# EasyEDA Pro project FSS1500-HANDv2.0.eprj

# Schematic Schematic1
Create Date: 2022-12-30; Page Name: P1; Project Name: FSS1500-HAND; Schematic Name: Schematic1; Update Date: 2023-02-28
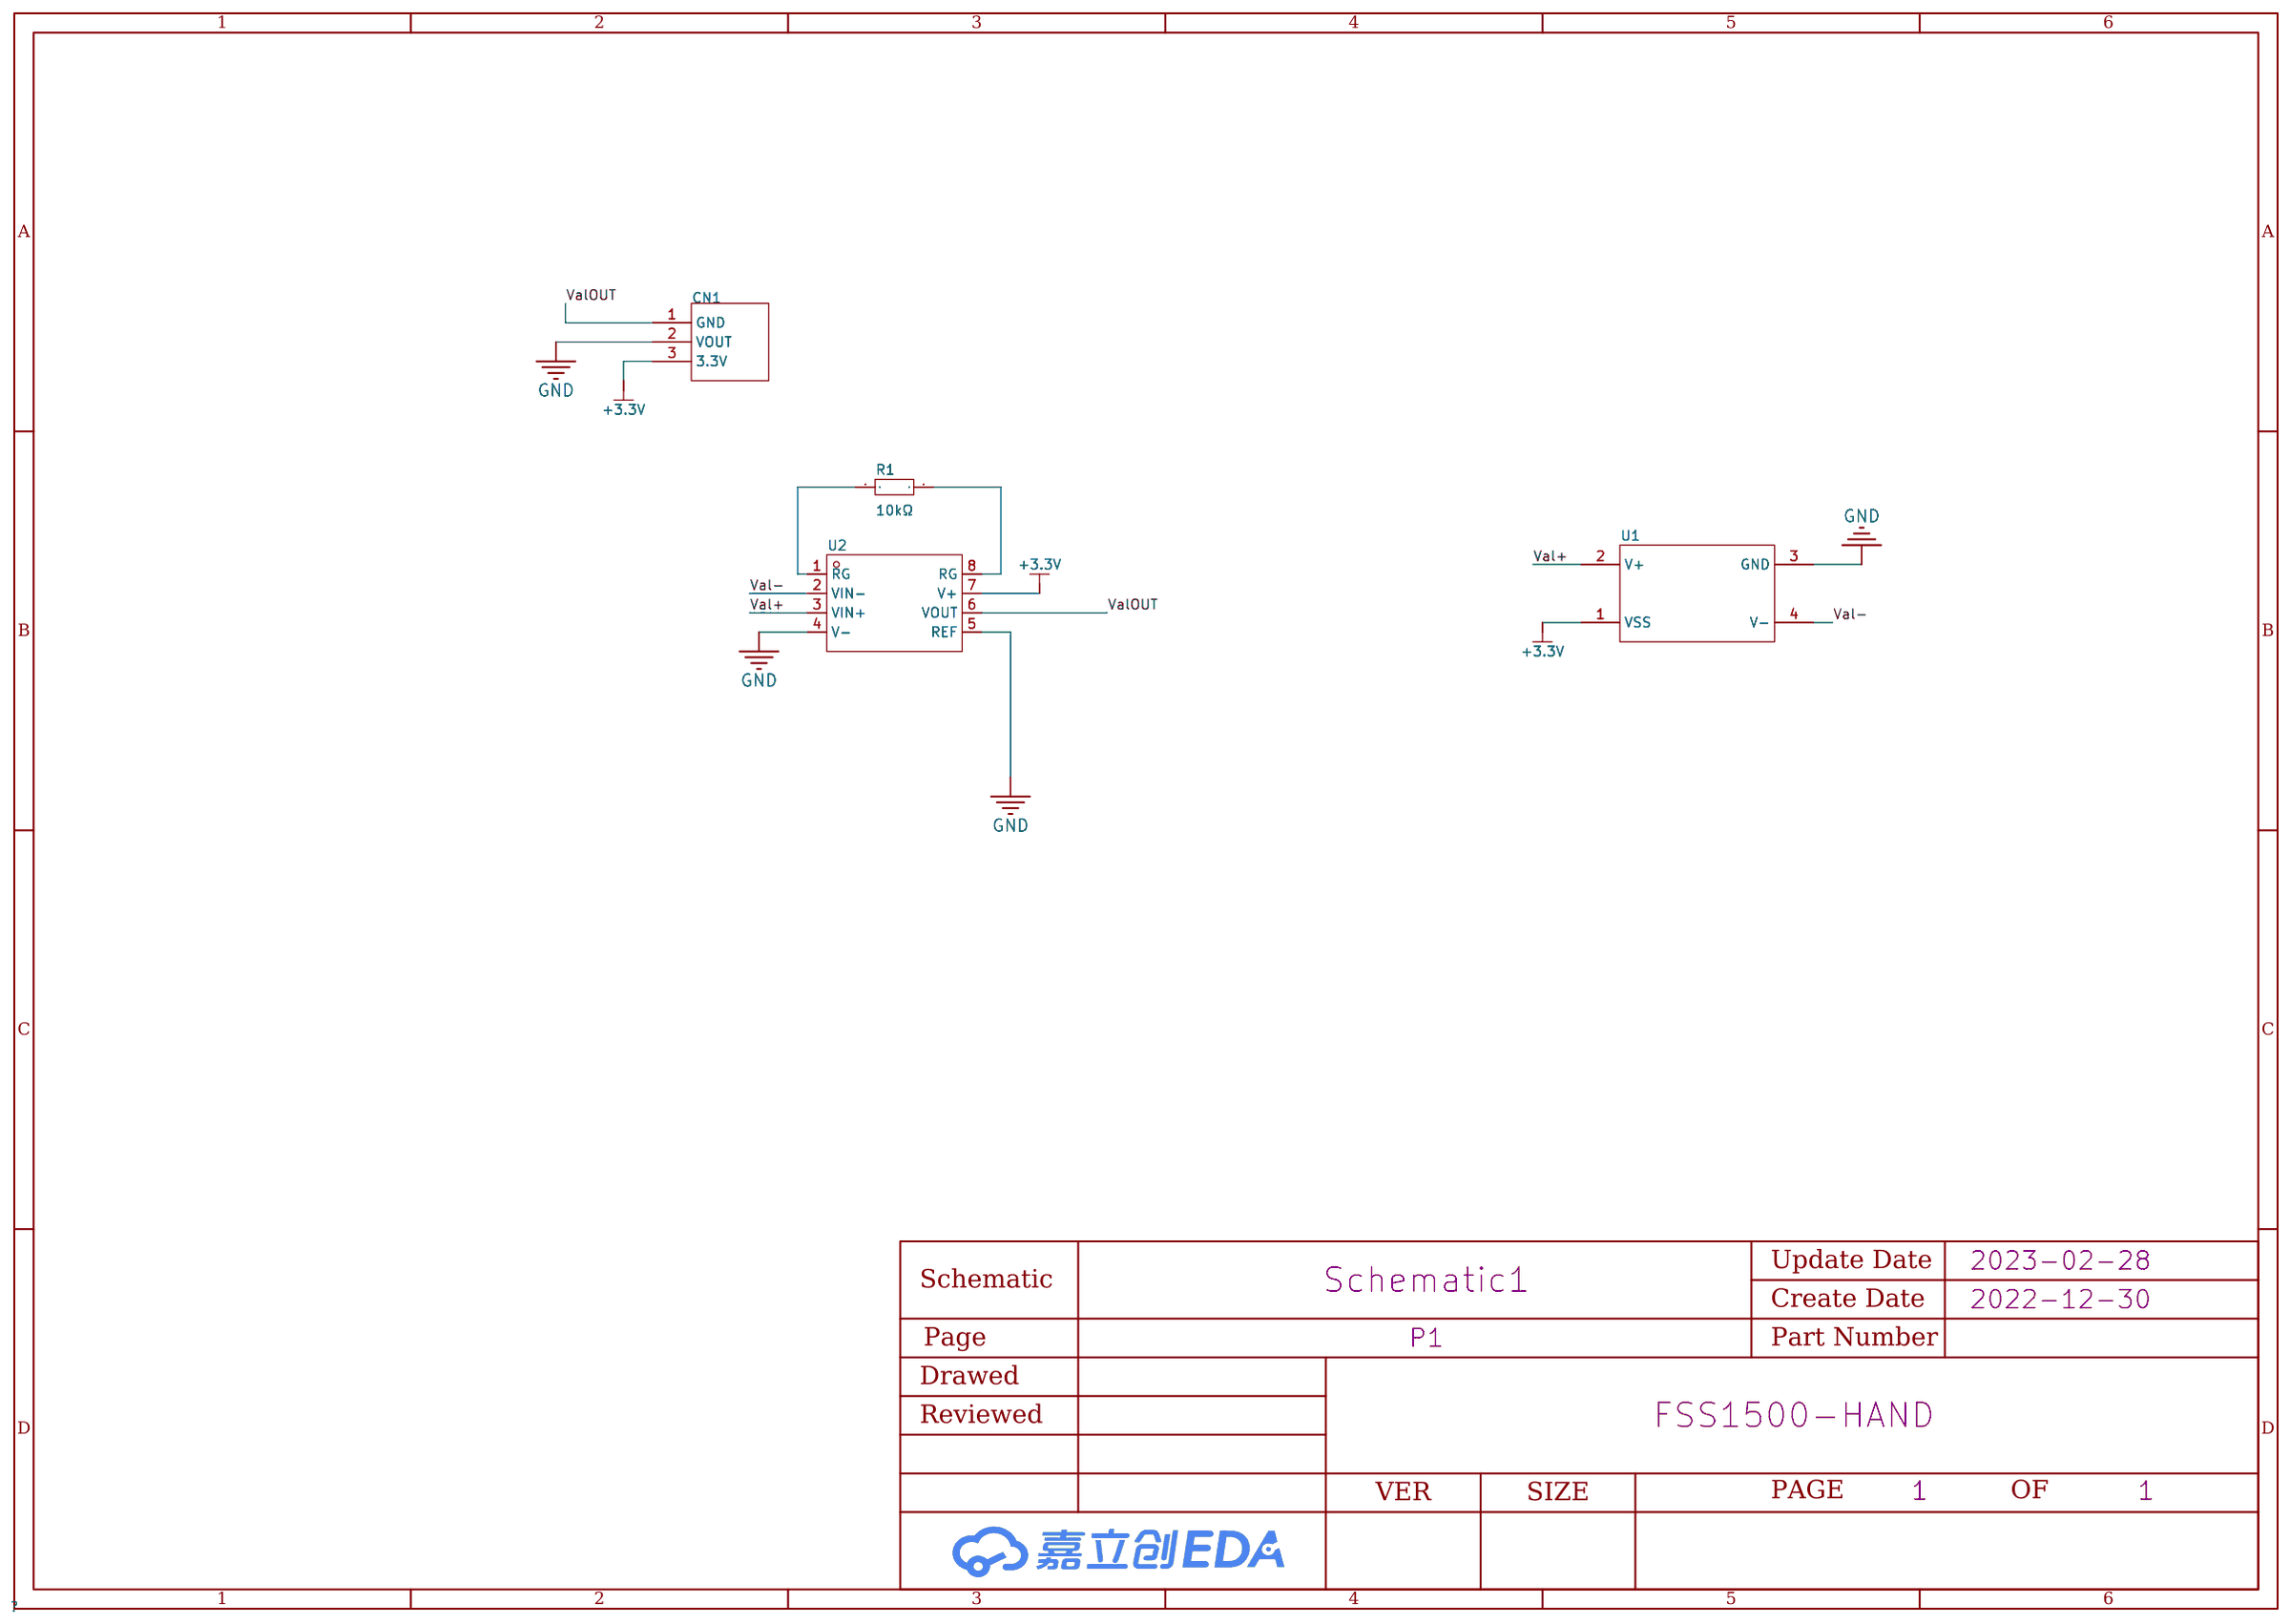
[diagram p0: schematic sheet]

## Parts
CN1  -  [3POINT]
R1  10kΩ  [R0603]
U1  -  [FSS1500NST]
U2  INA333AIDGKR  [MSOP-8_L3.0-W3.0-P0.65-LS5.0-BL]

## Library data of the parts
CN1 = 3POINT
R1 = CR0603JA0103G: 电阻类型:厚膜电阻;阻值:10kΩ;精度:±5%;功率:1/10W;温度系数:±200ppm/;最大工作电压:50V;工作温度范围:-55~+125;; LCSC Part Name: 10kΩ ±5%; Supplier Part: C101254; Manufacturer: LIZ(丽智电子); Supplier Footprint: 0603; JLCPCB Part Class: Extended Part; Datasheet: https://atta.szlcsc.com/upload/public/pdf/source/20170408/1491631441449.pdf; Supplier: LCSC; Type: 厚膜电阻; Tolerance: ±5%; Power(Watts): 1/10W; Temperature Coefficient: ±200ppm/; Overload Voltage (Max): 50V; Operating Temperature Range: -55~+125
U1 = FSS1500
U2 = INA333AIDGKR: 运放类型:Instrumentation;放大器组数:1;增益带宽积（GBP）:-;压摆率（SR）:0.16 V/us;电源电压:1.8V ~ 5.5V, ±0.9V ~ 2.75V;各通道供电电流:75uA;; Supplier Part: C19450; Manufacturer: TI(德州仪器); Supplier Footprint: VSSOP-8; JLCPCB Part Class: Extended Part; Datasheet: https://atta.szlcsc.com/upload/public/pdf/source/20130925/1457706651096.pdf; Supplier: LCSC; Amplifier Type: Instrumentation; Number of Circuits: 1; Slew Rate（SR）: 0.16 V/us; Output Type: Rail-to-Rail; Supply Voltage（Single）: 1.8V ~ 5.5V, ±0.9V ~ 2.75V; Iq per channel (Typ): 75uA; Operating Temperature: -40°C ~ 125°C

## Nets
+3.3V: CN1.3(3.3V) U1.1(VSS) U2.7(V+)
GND: CN1.2(VOUT) U1.3(GND) U2.4(V-) U2.5(REF)
Val+: U1.2(V+) U2.3(VIN+)
Val-: U1.4(V-) U2.2(VIN-)
ValOUT: CN1.1(GND) U2.6(VOUT)
$1N427: R1.1 U2.1(RG)
$1N434: R1.2 U2.8(RG)

# Board PCB1
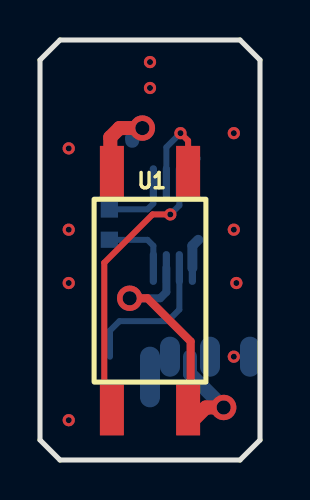
[diagram p1: board, top side]
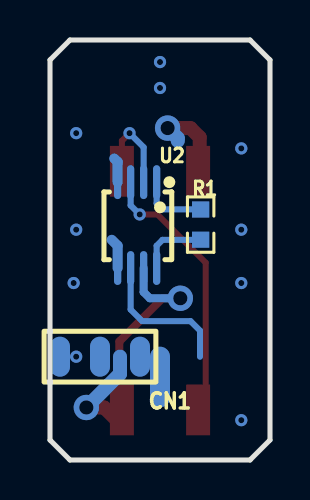
[diagram p2: board, bottom side, seen from below]

Outline 11 x 21 mm; copper layers: Top Layer, Bottom Layer. Coordinates in mm from the lower left corner of the outline.
Outline path: 0,20 0,1 1,0 10,0 11,1 11,20 10,21 1,21 0,20
Stack: Top Layer 0.035mm / Dielectric1 1.51mm FR4 er 4.5 / Bottom Layer 0.035mm

## Design rules (mm)
spacing safeClearance (default): track to track 0.152, other pairs 0.152 to 0.3
track width trackWidth (default): min 0.127, default 0.254, max 2.54
differential pair differentialPair (default): width min 0.127, default 0.254, max 2.54; gap min 0.152, default 0.152
via viaSize (default): diameter min 0.5, default 0.61, max 10; hole min 0.3, default 0.305, max 6

## Placement (name value [footprint] x y rotation side)
CN1  -  [3POINT]  5.5 5.17 0 bottom
R1  10kΩ  [R0603]  3.47 11.77 270 bottom
U1  -  [FSS1500NST]  5.5 8.47 90 top
U2  INA333AIDGKR  [MSOP-8_L3.0-W3.0-P0.65-LS5.0-BL]  6.64 11.75 0 bottom

## Footprints (pads in the part's own frame, mm; a bottom-side part is the same pattern mirrored in y, then rotated)
3POINT
  oval 1x2 smd: 1(1,0) 2(3,0) 3(5,0)
FSS1500NST
  rect 2.54x1.2 smd: 1(-5.967,-1.905) 2(-5.967,1.905) 3(5.967,1.905) 4(5.967,-1.905)
MSOP-8_L3.0-W3.0-P0.65-LS5.0-BL
  oval 0.363x1.692 smd: 1(-0.976,-2.147) 2(-0.325,-2.147) 3(0.325,-2.147) 4(0.976,-2.147) 5(0.976,2.147) 6(0.325,2.147) 7(-0.325,2.147) 8(-0.976,2.147)
R0603
  rect 0.807x0.864 smd: 1(-0.754,0) 2(0.754,0)

## Nets
+3.3V: CN1.3 U1.1 U2.7
GND: CN1.2 U1.3 U2.4 U2.5
VAL+: U1.2 U2.3
VAL-: U1.4 U2.2
VALOUT: CN1.1 U2.6
$1N427: R1.1 U2.1
$1N434: R1.2 U2.8

## Via types
v1: diameter 0.61, hole 0.305, Top Layer to Bottom Layer, 12 vias
v2: diameter 1.27, hole 0.711, Top Layer to Bottom Layer, 3 vias

## Routing (per net, layer and track width the routed paths; a pad name or vN(x,y) marks a point on that pad's centre or on a via; arc(x,y) is an arc through that point)
+3.3V: length 15.6
  Top Layer w0.4: 7.53,2.63 7.53,5.93 5.37,8.09 v2(4.48,8.09)
  Top Layer w0.7: v2(9.18,2.63) 8.29,2.63 7.53,1.86
  Bottom Layer w0.4: U2.7 6.32,8.4 6.01,8.09 v2(4.48,8.09)
  Bottom Layer w0.7: 7.5,5.17 7.5,4.31 v2(9.18,2.63)
GND: length 9.2
  Top Layer w0.7: U1.3 3.51,14.52 3.51,16.13 3.98,16.6 v2(5.12,16.6)
  Bottom Layer w0.5: U2.4 7.62,14.9 7.79,15.07 ; 7.91,11.01 7.62,10.71 U2.5
  Bottom Layer w0.7: 4.61,15.96 4.61,16.09 v2(5.12,16.6)
  Bottom Layer w1: 5.5,5.17 5.5,3.13
  vias: v1(1.44,15.58) v1(1.44,11.52) v1(1.44,8.85) v1(1.44,1.99) v1(5.5,19.9) v1(5.5,18.6) v1(9.69,16.34) v1(9.69,11.52) v1(9.69,5.17) v1(9.82,8.85)
VAL+: length 13.6
  Top Layer w0.3: v1(6.52,12.28) 5.63,12.28 3.21,9.86 3.21,2.88 U1.2
  Bottom Layer w0.3: v1(6.52,12.28) 6.97,12.73 U2.3
VAL-: length 5.2
  Top Layer w0.3: v1(7.02,16.34) 7.41,15.96 U1.4 7.66,14.18
  Bottom Layer w0.3: U2.2 6.32,15.64 v1(7.02,16.34)
VALOUT: length 7.3
  Bottom Layer w0.3: U2.6 6.97,7.52 6.39,6.94 3.98,6.94 3.5,6.47 3.5,5.17
$1N427: length 3.4
  Bottom Layer w0.3: R1.1 3.48,12.53 5.37,12.53 5.67,12.83 U2.1
$1N434: length 3.4
  Bottom Layer w0.3: R1.2 3.48,11.01 5.37,11.01 5.67,10.71 U2.8

## Copper pours and planes (outline as drawn; the poured copper is in the pictures)
GND on Top Layer: -0.82,21.82 11.6,21.82 11.6,-0.68 -0.82,-0.68
GND on Bottom Layer: -0.85,21.8 11.6,21.8 11.6,-0.68 -0.85,-0.68
